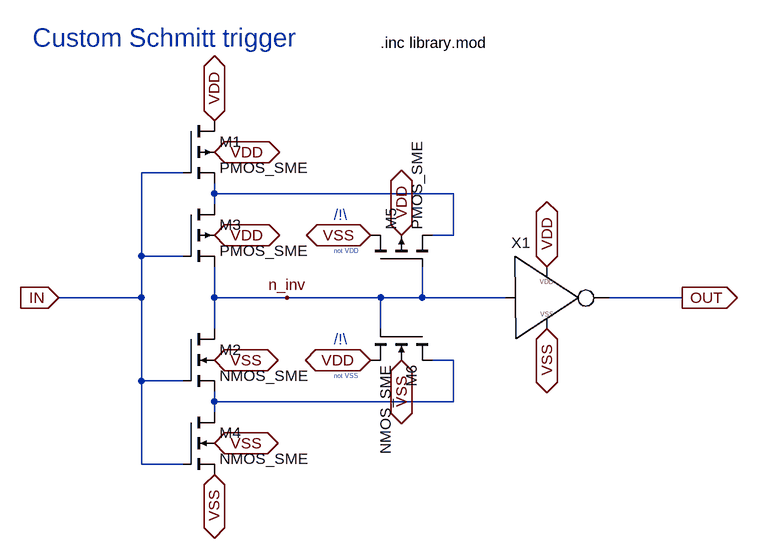
[diagram p0: schematic my_schmitt_trigger.asc]
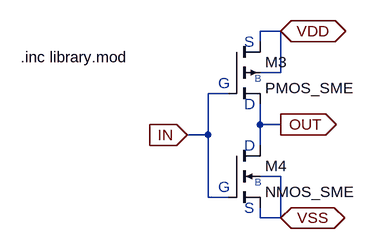
[diagram p1: sub-circuit my_inverter.asc]
my_schmitt_trigger.asc, the LTspice schematic file:
Version 4.1
SHEET 1 1300 892
WIRE 160 256 96 256
WIRE 208 288 208 272
WIRE 576 288 208 288
WIRE 208 304 208 288
WIRE 576 352 576 288
WIRE 576 352 544 352
WIRE 96 384 96 256
WIRE 160 384 96 384
WIRE 96 448 96 384
WIRE 96 448 -32 448
WIRE 208 448 208 400
WIRE 320 448 208 448
WIRE 464 448 320 448
WIRE 528 448 528 400
WIRE 528 448 464 448
WIRE 656 448 528 448
WIRE 928 448 816 448
WIRE 208 496 208 448
WIRE 464 496 464 448
WIRE 576 544 544 544
WIRE 96 576 96 448
WIRE 160 576 96 576
WIRE 208 608 208 592
WIRE 576 608 576 544
WIRE 576 608 208 608
WIRE 208 624 208 608
WIRE 96 704 96 576
WIRE 160 704 96 704
FLAG -32 448 IN
IOPIN -32 448 In
FLAG 928 448 OUT
IOPIN 928 448 Out
FLAG 208 176 VDD
IOPIN 208 176 BiDir
FLAG 208 224 VDD
IOPIN 208 224 BiDir
FLAG 208 352 VDD
IOPIN 208 352 BiDir
FLAG 208 720 VSS
IOPIN 208 720 BiDir
FLAG 448 352 VSS
IOPIN 448 352 BiDir
FLAG 496 352 VDD
IOPIN 496 352 BiDir
FLAG 496 544 VSS
IOPIN 496 544 BiDir
FLAG 208 544 VSS
IOPIN 208 544 BiDir
FLAG 208 672 VSS
IOPIN 208 672 BiDir
FLAG 448 544 VDD
IOPIN 448 544 BiDir
FLAG 320 448 n_inv
FLAG 720 400 VDD
IOPIN 720 400 BiDir
FLAG 720 496 VSS
IOPIN 720 496 BiDir
SYMBOL pmos4 160 176 R0
SYMATTR InstName M1
SYMATTR Value PMOS_SME
SYMATTR Value2 l=0.35u w=2u
SYMBOL nmos4 160 496 R0
SYMATTR InstName M2
SYMATTR Value NMOS_SME
SYMATTR Value2 l=0.35u w=1u
SYMBOL pmos4 160 304 R0
SYMATTR InstName M3
SYMATTR Value PMOS_SME
SYMATTR Value2 l=0.35u w=2u
SYMBOL nmos4 160 624 R0
SYMATTR InstName M4
SYMATTR Value NMOS_SME
SYMATTR Value2 l=0.35u w=1u
SYMBOL pmos4 448 400 R270
SYMATTR InstName M5
SYMATTR Value PMOS_SME
SYMATTR Value2 l=0.35u w=0.8u
SYMBOL nmos4 544 496 R90
SYMATTR InstName M6
SYMATTR Value NMOS_SME
SYMATTR Value2 l=0.35u w=0.4u
SYMBOL my_inverter 720 448 R0
WINDOW 0 -40 -69 Bottom 2
SYMATTR InstName X1
TEXT -72 48 Left 4 ;Custom Schmitt trigger
TEXT 464 56 Left 2 !.inc library.mod
TEXT 392 320 Left 2 ;/!\\
TEXT 392 512 Left 2 ;/!\\
TEXT 392 376 Left 0 ;not VDD
TEXT 392 568 Left 0 ;not VSS

my_inverter.asc, the sub-circuit schematic file:
Version 4.1
SHEET 1 880 680
WIRE 608 -32 576 -32
WIRE 576 -16 576 -32
WIRE 608 32 608 -32
WIRE 608 32 576 32
WIRE 528 64 496 64
WIRE 576 112 576 80
WIRE 608 112 576 112
WIRE 496 128 496 64
WIRE 496 128 464 128
WIRE 576 144 576 112
WIRE 608 192 576 192
WIRE 496 224 496 128
WIRE 528 224 496 224
WIRE 576 256 576 240
WIRE 608 256 608 192
WIRE 608 256 576 256
FLAG 608 -32 VDD
IOPIN 608 -32 BiDir
FLAG 608 256 VSS
IOPIN 608 256 BiDir
FLAG 608 112 OUT
IOPIN 608 112 Out
FLAG 464 128 IN
IOPIN 464 128 In
SYMBOL pmos4 528 -16 R0
SYMATTR InstName M3
SYMATTR Value PMOS_SME
SYMATTR Value2 l=0.35u w=0.4u
SYMBOL nmos4 528 144 R0
SYMATTR InstName M4
SYMATTR Value NMOS_SME
SYMATTR Value2 l=0.35u w=0.4u
TEXT 552 -16 Left 2 ;S
TEXT 552 240 Left 2 ;S
TEXT 552 80 Left 2 ;D
TEXT 552 144 Left 2 ;D
TEXT 512 48 Left 2 ;G
TEXT 512 208 Left 2 ;G
TEXT 568 40 Left 1 ;B
TEXT 568 200 Left 1 ;B
TEXT 208 8 Left 2 !.inc library.mod

The netlist it stands for:
* my_schmitt_trigger.asc
M1 VDD IN N001 VDD PMOS_SME l=0.35u w=2u
M2 n_inv IN N002 VSS NMOS_SME l=0.35u w=1u
M3 N001 IN n_inv VDD PMOS_SME l=0.35u w=2u
M4 N002 IN VSS VSS NMOS_SME l=0.35u w=1u
M5 VSS n_inv N001 VDD PMOS_SME l=0.35u w=0.8u
M6 N002 n_inv VDD VSS NMOS_SME l=0.35u w=0.4u
X§X1 n_inv OUT VDD VSS my_inverter

* block symbol definitions
.subckt my_inverter IN OUT VDD VSS
M3 VDD IN OUT VDD PMOS_SME l=0.35u w=0.4u
M4 OUT IN VSS VSS NMOS_SME l=0.35u w=0.4u
* S
* S
* D
* D
* G
* G
* B
* B
.inc library.mod
.ends my_inverter

.model NMOS NMOS
.model PMOS PMOS
.lib standard.mos
* Custom Schmitt trigger
.inc library.mod
* /!\
* /!\
* not VDD
* not VSS
.backanno
.end